# EAGLE schematic Shield_Kazi (EAGLE 9.5.1)
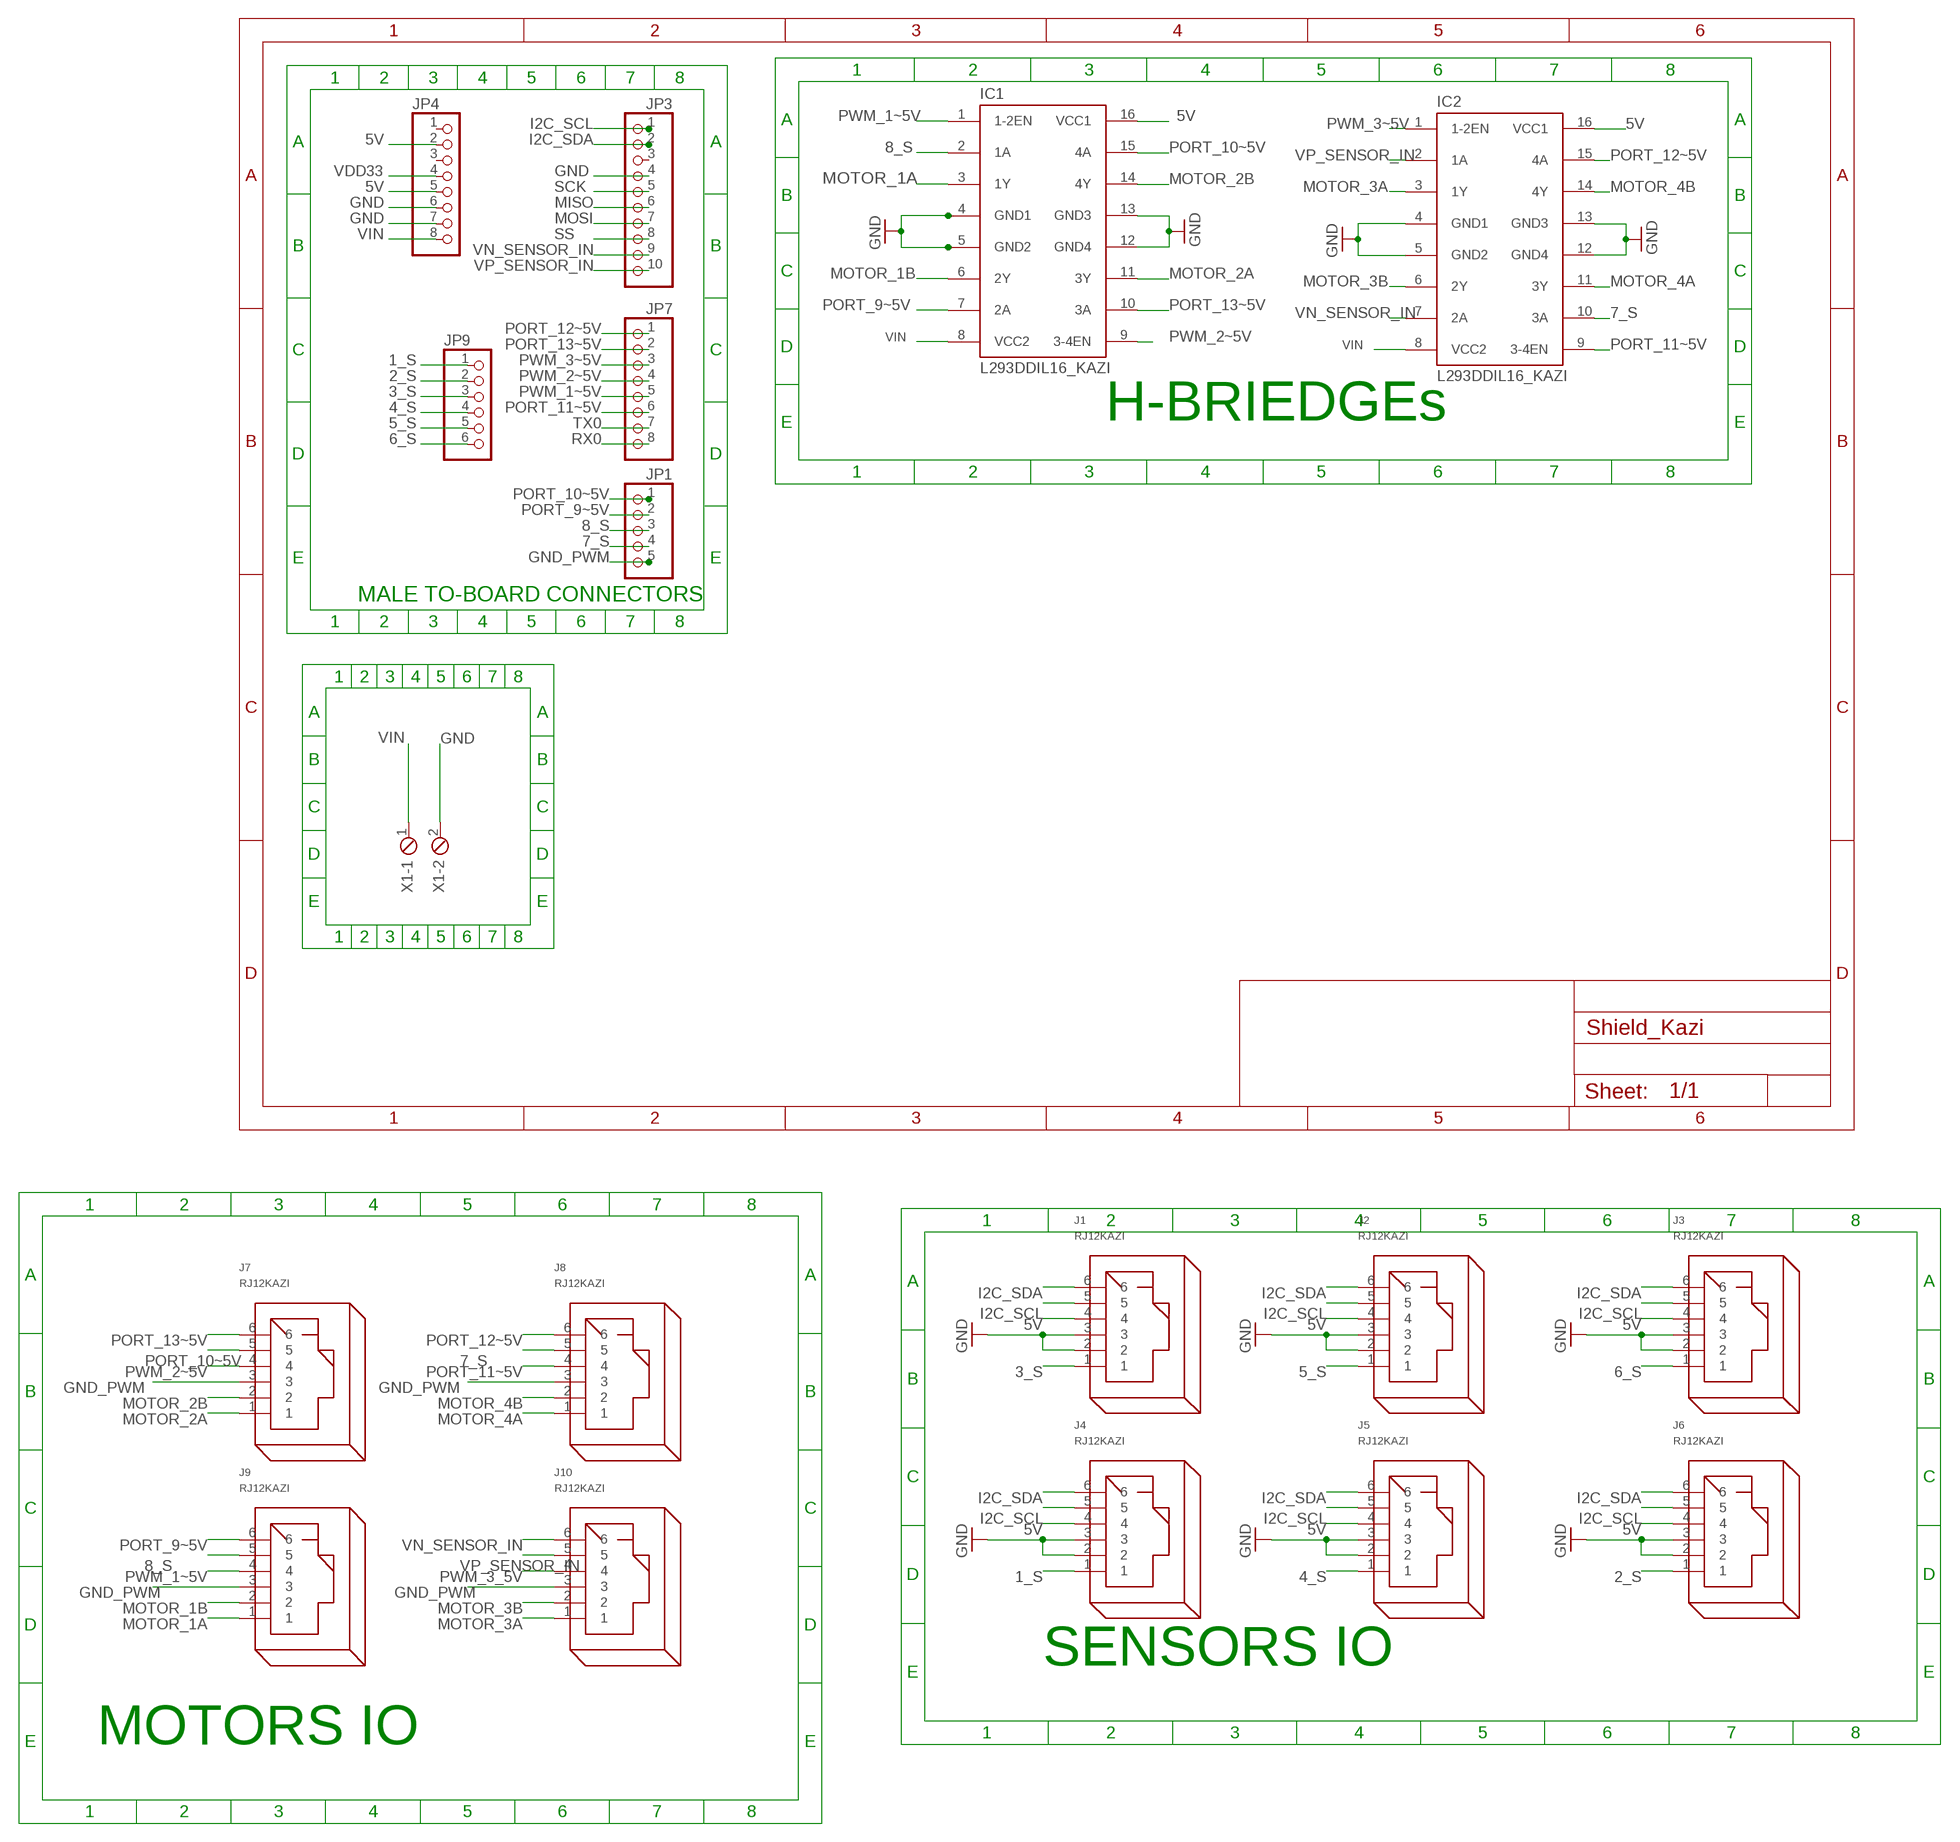
[diagram p0: schematic, sheet 1]

## Parts
IC1  L293DDIL16_KAZI  [DIL16_KAZI]
IC2  L293DDIL16_KAZI  [DIL16_KAZI]
J1  RJ12KAZI  [RJ12_KAZI]
J2  RJ12KAZI  [RJ12_KAZI]
J3  RJ12KAZI  [RJ12_KAZI]
J4  RJ12KAZI  [RJ12_KAZI]
J5  RJ12KAZI  [RJ12_KAZI]
J6  RJ12KAZI  [RJ12_KAZI]
J7  RJ12KAZI  [RJ12_KAZI]
J8  RJ12KAZI  [RJ12_KAZI]
J9  RJ12KAZI  [RJ12_KAZI]
J10  RJ12KAZI  [RJ12_KAZI]
JP1  PINHD-1X5_2.54-SMD  [1X05SMD]
JP3  PINHD-1X10_2.54-SMD  [1X10SMD]
JP4  PINHD-1X8_2.54-SMD  [1X08SMD]
JP7  PINHD-1X8_2.54-SMD  [1X08SMD]
JP9  PINHD-1X6_2.54-SMD  [1X06SMD]
X1  MPT21.3  [2POL254_1.3]

## Nets
1_S: J4.1 JP9.1
2_S: J6.1 JP9.2
3_S: J1.1 JP9.3
4_S: J5.1 JP9.4
5_S: J2.1 JP9.5
5V: IC1.16(VCC1) IC2.16(VCC1) J1.4 J2.4 J3.4 J4.4 J5.4 J6.4 JP4.2 JP4.5
6_S: J3.1 JP9.6
7_S: IC2.10(3A) J8.5 JP1.4
8_S: IC1.2(1A) J9.5 JP1.3
GND: IC1.4(GND1) IC1.5(GND2) IC1.12(GND4) IC1.13(GND3) IC2.4(GND1) IC2.5(GND2) IC2.12(GND4) IC2.13(GND3) J1.2 J1.3 J2.2 J2.3 J3.2 J3.3 J4.2 J4.3 J5.2 J5.3 J6.2 J6.3 JP3.4 JP4.6 JP4.7 X1.2
GND_PWM: J7.3 J8.3 J9.3 J10.3 JP1.5
I2C_SCL: J1.5 J2.5 J3.5 J4.5 J5.5 J6.5 JP3.1
I2C_SDA: J1.6 J2.6 J3.6 J4.6 J5.6 J6.6 JP3.2
MISO: JP3.6
MOSI: JP3.7
MOTOR_1A: IC1.3(1Y) J9.1
MOTOR_1B: IC1.6(2Y) J9.2
MOTOR_2A: IC1.11(3Y) J7.1
MOTOR_2B: IC1.14(4Y) J7.2
MOTOR_3A: IC2.3(1Y) J10.1
MOTOR_3B: IC2.6(2Y) J10.2
MOTOR_4A: IC2.11(3Y) J8.1
MOTOR_4B: IC2.14(4Y) J8.2
PORT_9~5V: IC1.7(2A) J9.6 JP1.2
PORT_10~5V: IC1.15(4A) J7.5 JP1.1
PORT_11~5V: IC2.9(3-4EN) J8.4 JP7.6
PORT_12~5V: IC2.15(4A) J8.6 JP7.1
PORT_13~5V: IC1.10(3A) J7.6 JP7.2
PWM_1~5V: IC1.1(1-2EN) J9.4 JP7.5
PWM_2~5V: IC1.9(3-4EN) J7.4 JP7.4
PWM_3_5V: J10.4
PWM_3~5V: IC2.1(1-2EN) JP7.3
RX0: JP7.8
SCK: JP3.5
SS: JP3.8
TX0: JP7.7
VDD33: JP4.4
VIN: IC1.8(VCC2) IC2.8(VCC2) JP4.8 X1.1
VN_SENSOR_IN: IC2.7(2A) J10.6 JP3.9
VP_SENSOR_IN: IC2.2(1A) J10.5 JP3.10
Unconnected: JP3.3 JP4.1 JP4.3

## Notes on the sheet
- H-BRIEDGEs
- MALE TO-BOARD CONNECTORS
- SENSORS IO
- MOTORS IO

## Library data of the parts
IC1 IC2 = st-microelectronics_KAZI:L293D: PUSH-PULL 4 CHANNEL DRIVER
J1-J10 = con-rj:RJ12: RJ12, RJ14 and RJ25 RJ12, RJ14 and RJ25 jacks side mounted http://www.tycoelectronics.com
JP1 = pinhead-1:PINHD-1X5: PIN HEADER
JP3 = pinhead-1:PINHD-1X10: PIN HEADER
JP4 JP7 = pinhead-1:PINHD-1X8: PIN HEADER
JP9 = pinhead-1:PINHD-1X6: PIN HEADER
X1 = con-phoenix-254:MPT2: PHOENIX CONNECTOR

## Net classes
0 default: width 0.61 mm, drill 0.61 mm, clearance 0.254 mm